# Altium schematic sheet Information.SchDoc
size A3; Author: Alptron AB; CompanyName: Alptron AB; DrawnBy: Caner Alp; Engineer: Caner Alp; Organization: Alptron AB; Address2: Vaesteas; Address4: Sweden; DocumentNumber: 5; SheetNumber: 5; SheetTotal: 5
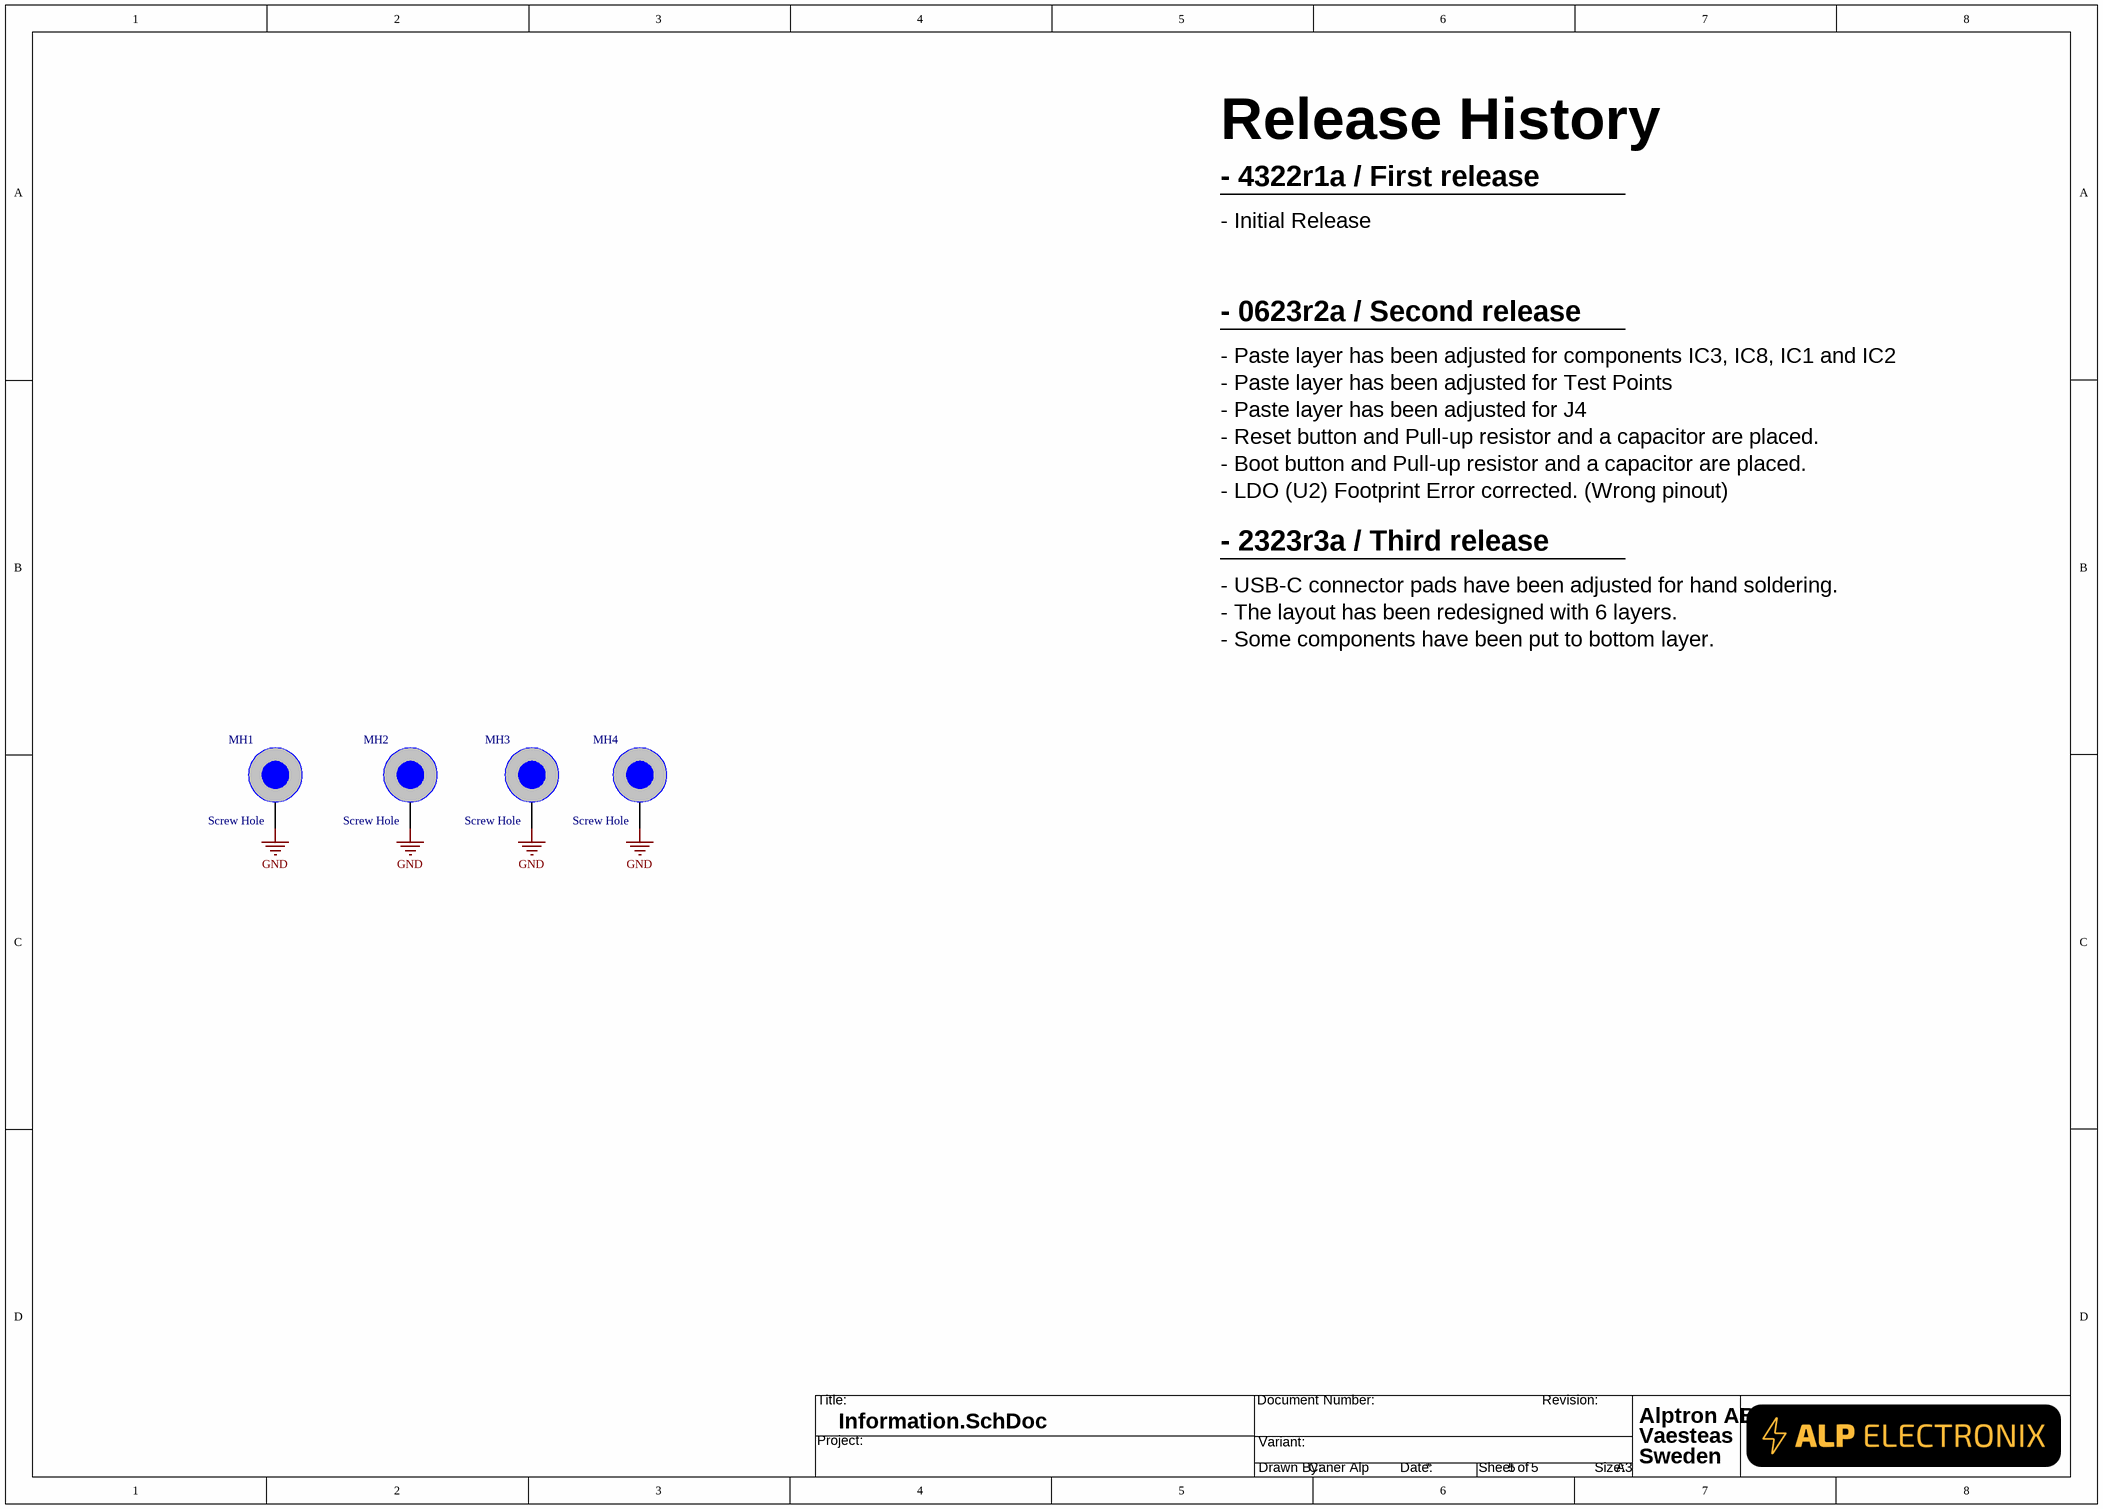
[diagram p0: Information.SchDoc]

## Parts
MH1  Screw Hole  [M3 Screw]  (no BOM)
MH2  Screw Hole  [M3 Screw]  (no BOM)
MH3  Screw Hole  [M3 Screw]  (no BOM)
MH4  Screw Hole  [M3 Screw]  (no BOM)

## Nets
GND: MH1.1 MH2.1 MH3.1 MH4.1

## Notes on the sheet
- Release History
- - 4322r1a / First release
- - Initial Release
- - 0623r2a / Second release
- - Paste layer has been adjusted for components IC3, IC8, IC1 and IC2
- - Paste layer has been adjusted for Test Points
- - Reset button and Pull-up resistor and a capacitor are placed.
- - Paste layer has been adjusted for J4
- - Boot button and Pull-up resistor and a capacitor are placed.
- - LDO (U2) Footprint Error corrected. (Wrong pinout)
- - 2323r3a / Third release
- - USB-C connector pads have been adjusted for hand soldering.
- - The layout has been redesigned with 6 layers.
- - Some components have been put to bottom layer.
- Title:
- Project:
- Document Number:
- Variant:
- Revision:
- Drawn By:
- Date:
- Sheet
- of
- Size:
- A3